# Altium project in3ator.PrjPcb
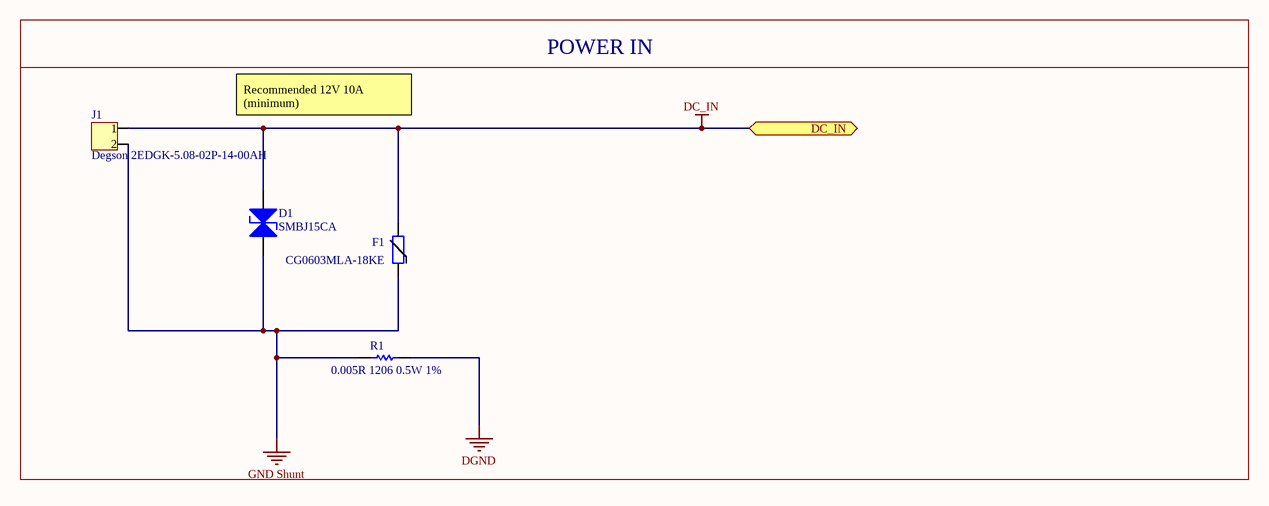
[diagram p0: Power_Input.SchDoc]
Author_in3: Pablo Sánchez Bergasa; Revision_in3: 2.B.1; SheetTotal_in3: 10
3 sheets, 63 parts. Net scope: flat (ports and power ports of the same name join across sheets).
Sheets:
  Power_Input.SchDoc
  Power_management.SchDoc
  Sensors.SchDoc

## Sheet Power_Input.SchDoc: Power input
size A4; SheetNumber: 2

### Parts
D1  SMBJ15CA  [PCB-acsqsz06h0bi34fqghyj-1]
F1  CG0603MLA-18KE  [CAPC1608X60X35NL10T15]
J1  Degson 2EDGK-5.08-02P-14-00AH  [PCB-h4cyb3wxd4gf7j132tzl-1]
R1  0.005R 1206 0.5W 1%  [CAPC3216X180X55ML20T25]

### Blocks framed on the sheet
POWER IN: D1 F1 J1 R1

### Ports
DC_IN

### Nets
DC_IN: D1.2(K) F1.2 J1.1 ; port DC_IN
DGND: R1.1
GND Shunt: D1.1(A) F1.1 J1.2 R1.2

### Notes on the sheet
- Recommended 12V 10A (minimum)
- Title
- Size:
- Date:
- A3
- Author:
- Time:
- Revision:
- Sheet
- of
- File:

### Library data of the parts
D1 = CMP-f09b39914f642f5c-1: SMBJ15 Series 24.4 V 600 W Bi-Directional Transient Voltage Suppressor-DO-214AA; Power Dissipation: 5.00 W; Breakdown Voltage: 16.7 V; Power Rating: 600 W; Octopart URL: http://octopart.com/smbj15ca-littelfuse-39577; Mounting Style: Surface Mount; RoHS: Compliant
F1 = CMP-c3730a7940881cb4-1: Var MOV 14VAC 18VDC 30A 24.2V 0603 SMD Paper T/R Var MOV 14VAC 18VDC 30A 24.2V 0603 SMD Paper T/R; Capacitance: 140 pF; Operating Voltage: 14.0 V; Voltage Rating (DC): 18.0 V; Octopart URL: https://octopart.com/cg0603mla-18ke-bourns-42653; Manufacturer Part Number: CG0603MLA-18KE; Case/Package: 0603; Mounting Style: Surface Mount, Solder; Operating Temperature: -55.0 °C (min); Packaging: Reel; REACH SVHC Compliance: No SVHC; RoHS: Compliant; Size-Height: 813 µm; Size-Length: 1.63 mm; Size-Width: 813 µm; Voltage Rating (AC): 14.0 V; OctopartID: c3730a7940881cb4
J1 = CMP-7a42b7ee166ba585-1: Terminal block, 5mm 2 Pos, through hole male.; Manufacturer Part Number: 2EDGK-5.08-02P-14-00AH + 2EDGVC-5.08-02P; Octopart URL: https://octopart.com/2edgk-5.08-02p-14-00ah-degson-78006607; OctopartID: 7a42b7ee166ba585; Manufacturer Part Number 2: WJ2EDGVC-5.08-2P + WJ2EDGK-5.08-2P
R1 = CMP-0abdc173b10ad57a-1: Manufacturer Part Number: WSLP12065L000FEA; Resistance: 0,024; Power: 1W; Octopart URL: https://octopart.com/1-2176055-0-te+connectivity-46440145; Case/Package: 1206; Lifecycle Status: Not Listed by Manufacturer; Packaging: Tape & Reel (TR); OctopartID: 0abdc173b10ad57a; OrderingCode: WSLP12065L000FEA; Manufacturer Part Number 2: FMF06FTHR005-LHL

## Sheet Power_management.SchDoc: Power
size A3; SheetNumber: 3
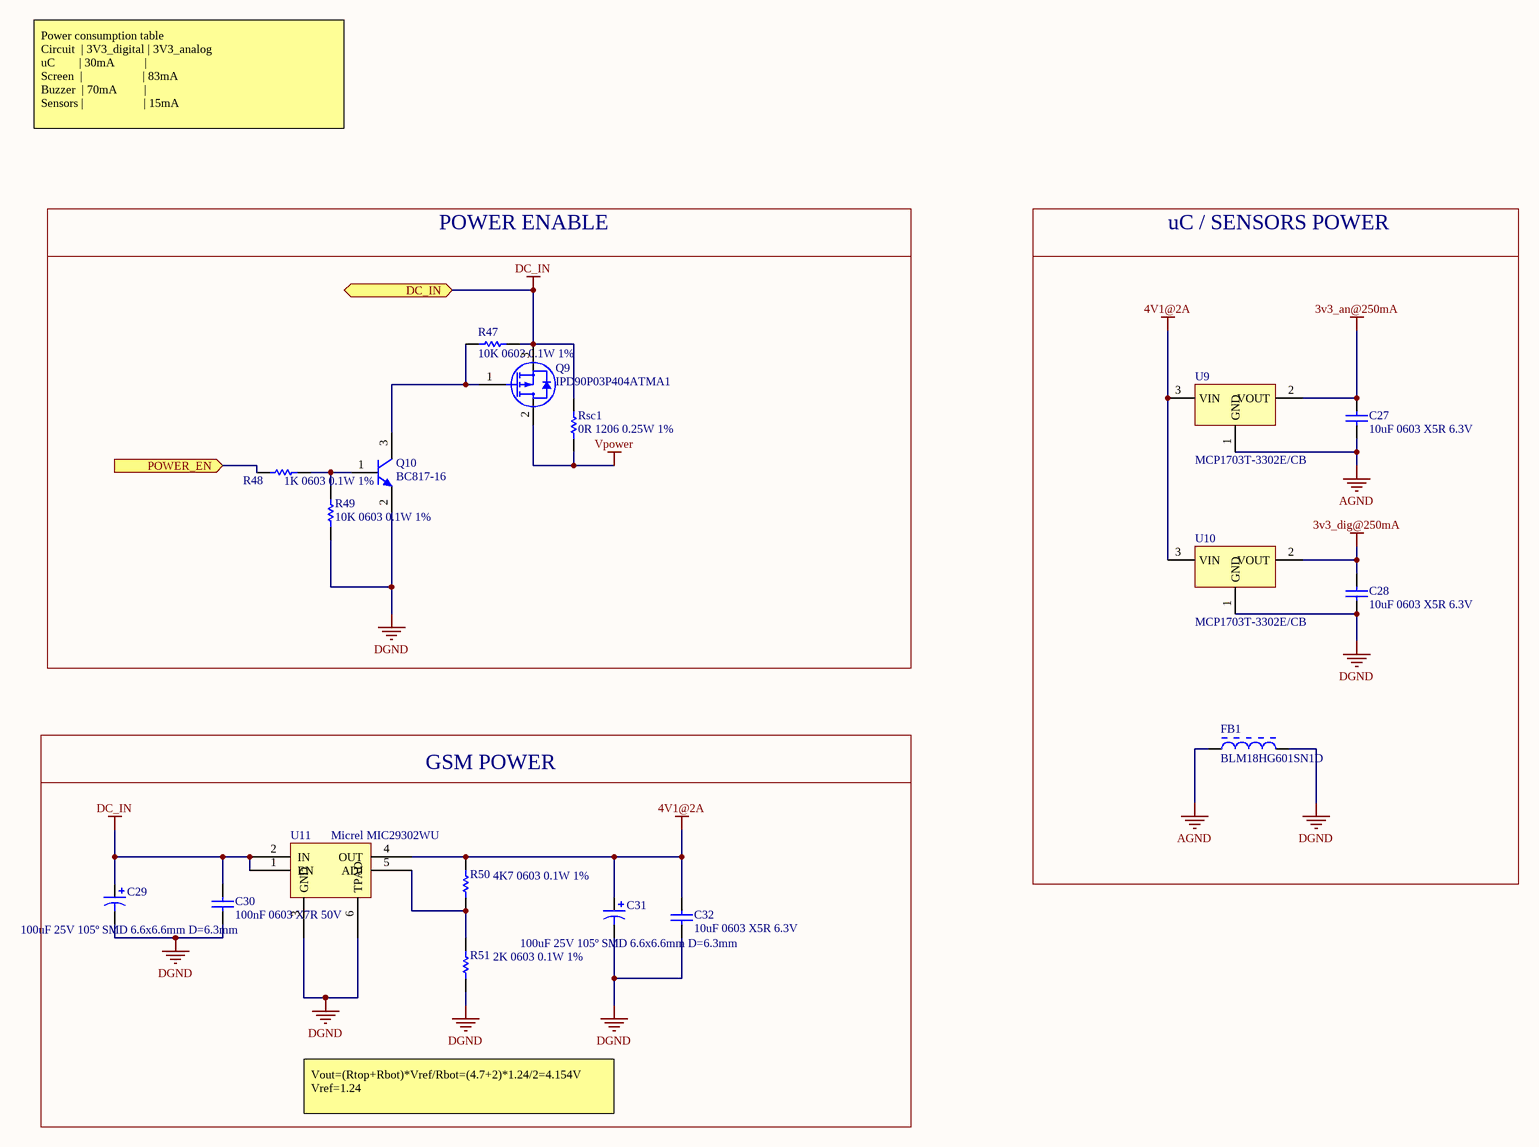
[diagram p1: Power_management.SchDoc]

### Parts
C27  10uF 0603 X5R 6.3V  [CAPC1608X60X35NL10T15]
C28  10uF 0603 X5R 6.3V  [CAPC1608X60X35NL10T15]
C29  100uF 25V 105º SMD 6.6x6.6mm D=6.3mm  [PCB-5eg0a5nygcrzw5ibm1j9-1]
C30  100nF 0603 X7R 50V  [CAPC1608X60X35NL10T15]
C31  100uF 25V 105º SMD 6.6x6.6mm D=6.3mm  [PCB-5eg0a5nygcrzw5ibm1j9-1]
C32  10uF 0603 X5R 6.3V  [CAPC1608X60X35NL10T15]
FB1  BLM18HG601SN1D  [MURA-BLM18-F-H1-CHIP-2_V]
Q9  IPD90P03P404ATMA1  [DPAK IPD90P03P404ATMA1]
Q10  BC817-16  [PCB-856332-1]
R47  10K 0603 0.1W 1%  [RESC1609X55X30ML10T20]
R48  1K 0603 0.1W 1%  [RESC1609X55X30ML10T20]
R49  10K 0603 0.1W 1%  [RESC1609X55X30ML10T20]
R50  4K7 0603 0.1W 1%  [RESC1609X55X30ML10T20]
R51  2K 0603 0.1W 1%  [RESC1609X55X30ML10T20]
Rsc1  0R 1206 0.25W 1%  [PCB-sxvxwfnl72ysl1kmtzgv-1]  (no BOM)
U9  MCP1703T-3302E/CB  [SOT-23A-CB3_L]
U10  MCP1703T-3302E/CB  [SOT-23A-CB3_L]
U11  Micrel MIC29302WU  [TI-KTT5_N]

### Blocks framed on the sheet
POWER ENABLE: Q9 Q10 R47-R49 Rsc1
uC / SENSORS POWER: C27 C28 FB1 U9 U10
GSM POWER: C29-C32 R50 R51 U11

### Ports
DC_IN, POWER_EN (in)

### Nets
3v3_an@250mA: C27.2 U9.2(VOUT)
3v3_dig@250mA: C28.2 U10.2(VOUT)
4V1@2A: C31.1 C32.2 R50.2 U9.3(VIN) U10.3(VIN) U11.4(OUT)
AGND: C27.1 FB1.1 U9.1(GND)
DC_IN: C29.1 C30.2 Q9.3(S) R47.2 Rsc1.2 U11.1(EN) U11.2(IN) ; port DC_IN
DGND: C28.1 C29.2 C30.1 C31.2 C32.1 FB1.2 Q10.2(E) R49.2 R51.1 U10.1(GND) U11.3(GND) U11.6(TPAD)
Vpower: Q9.2(D) Rsc1.1
NetQ9_1: Q9.1(G) Q10.3(C) R47.1
NetQ10_1: Q10.1(B) R48.2 R49.1
NetR48_1: R48.1 ; port POWER_EN
NetR50_1: R50.1 R51.2 U11.5(ADJ)

### Notes on the sheet
- Power consumption table
  Circuit  | 3V3_digital | 3V3_analog
  uC        | 30mA          |
  Screen  |                    | 83mA
  Buzzer  | 70mA         |
  Sensors |                    | 15mA
- Vout=(Rtop+Rbot)*Vref/Rbot=(4.7+2)*1.24/2=4.154V
  Vref=1.24
- Title
- Size:
- Date:
- A3
- Author:
- Time:
- Revision:
- Sheet
- of
- File:

### Library data of the parts
C27 C28 C32 = CMP-121364-8: Rated voltage: 6v3; Dielectric carachteristic: X5R; Capacitance: 10uF; package: 0603
C29 C31 = CMP-a6d16ad512617916-1: Manufacturer Part Number: VZL101M1ETR-0607; Tolerance: 20%; Octopart URL: https://octopart.com/vzl101m1etr-0607-lelon-84840918; OctopartID: a6d16ad512617916; Capacity: 100uF; Voltage rating: 25V
C30 = CMP-c41a0d2b65641bdd-3: 100nF 0603 X7R 25V; package: 0603; capacitance: 100 nF; Dielectric Characteristic: X7R; Rated voltage: 25V
FB1 = CMP-19299602-3: Current Rating: 0.2 A; Frequency: 100000000.0 Hz; Lead-Free Status: Lead Free; Number of Circuits: 1; Resistance: 600.0 Ω; Shielding: No; Value: 600ohm 200mA; Manufacturer Part Number: BLM18HG601SN1D; Case/Package: 0603; Mounting Style: Surface Mount; Number of Pins: 2; Octopart Url: https://octopart.com/blm18hg601sn1d-murata-368340; OctopartID: c121082e7a931ee6; REACH SVHC Compliance: No SVHC; RoHS: Compliant; Size-Height: 0.0008 m; Size-Length: 0.0016 m; Size-Width: 0.0008 m
Q9 = CMP-3103264-6: Single P-Channel 30 V 4.5 mOhm 100 nC OptiMOS Power Mosfet - TO-252-3-11; Lead-Free Status: Lead Free; REACH SVHC Compliance: No SVHC; Octopart URL: https://octopart.com/ipd90p03p404atma1-infineon-21386769; Polarity: P-Channel; RoHS: Compliant; Mounting Style: Surface Mount; Operating Temperature: 175 °C (max); Packaging: Reel; Number of Pins: 3; OctopartID: f6ad3ee185da296a; Manufacturer Part Number: IPD90P03P404ATMA1; Manufacturer Part Number 2: WSF70P03
Q10 = CMP-856332-3: TRANS NPN 45V 500mA SMD SOT23-3; Current Rating: 0.6 A; Lead-Free Status: Lead Free; Power Dissipation: 0.3 W; Voltage Rating (DC): 40.0 V; Case/Package: SOT-23; Lifecycle Status: Active; Mounting Style: Surface Mount; Number of Pins: 3; Octopart Url: https://octopart.com/mmbt2222a-7-f-diodes+inc.-357838; OctopartID: 53a79aa8030f8c60; Packaging: Cut Tape (CT); Polarity: NPN; REACH SVHC Compliance: No SVHC; RoHS: Compliant
R47 R49 = CMP-4716590-9: Octopart Url: https://octopart.com/crcw060310k0fkeahp-vishay-42634028; package: 0603; Resistance: 10k; Tolerance: 1%
  R47: DNP: DNP
R48 = CMP-a61f6f36030f79d8-4: Manufacturer Part Number: CR0603-FX-1001ELF; Power Rating: 100 mW; Case/Package (SI): 1608; Voltage Rating (DC): 50.0 V; Temperature Coefficient: -100 ppm/°C to 100 ppm/°C; REACH SVHC Compliance: No SVHC; Packaging: Tape & Reel (TR), Cut Tape (CT); Resistance Tolerance: ±1%; Resistance: 1k; RoHS: Compliant; Mounting Style: Surface Mount; Number of Pins: 2; Size-Length: 1.60 mm; Octopart URL: https://octopart.com/cr0603-fx-1001elf-bourns-2326646; Size-Thickness: 457 µm; OctopartID: a61f6f36030f79d8; Size-Width: 787 µm; Case/Package: 0603
R50 R51 = CMP-3655986-6: Tolerance: 1%; package: 0603
  R50: Resistance: 4K7
  R51: Resistance: 2K
Rsc1 = CMP-3f1bf473a47ce0dc-5: Manufacturer Part Number: RC1206JR-070RL; Lead-Free Status: Lead Free; Resistance Tolerance: ±5%; Voltage Rating (DC): 200 V; Power Rating: 250 mW; Case/Package (SI): 3216; Resistance: 0R; Packaging: Cut Tape (CT), Tape & Reel (TR); Size-Width: 1.60 mm; Case/Package: 1206; Mounting Style: Surface Mount; Size-Length: 3.10 mm; OctopartID: 3f1bf473a47ce0dc; Number of Pins: 2; RoHS: Compliant
U9 U10 = CMP-1493313-4: Lead-Free Status: Lead Free; Number of Outputs: 1; Output Capacitor Type: Ceramic; Quiescent Current: 2e-06 A; Dropout Voltage: 0.65 V; RoHS: Compliant; Mounting Style: Surface Mount; OctopartID: 3caef5ca6a72e369; Packaging: Cut Tape (CT); Octopart Url: https://octopart.com/mcp1703t-3302e%2Fcb-microchip-7238586; Lifecycle Status: Active; Number of Pins: 3; REACH SVHC Compliance: No SVHC; Manufacturer Part Number: MCP1703T-3302E/CB
U11 = CMP-703eb93c7bacaff9-6: MIC29302 Series 3 A 1.24 to 26 V ADJ Output Voltage LDO Regulator - TO-263-5

## Sheet Sensors.SchDoc: Sensors
size A3; SheetNumber: 7
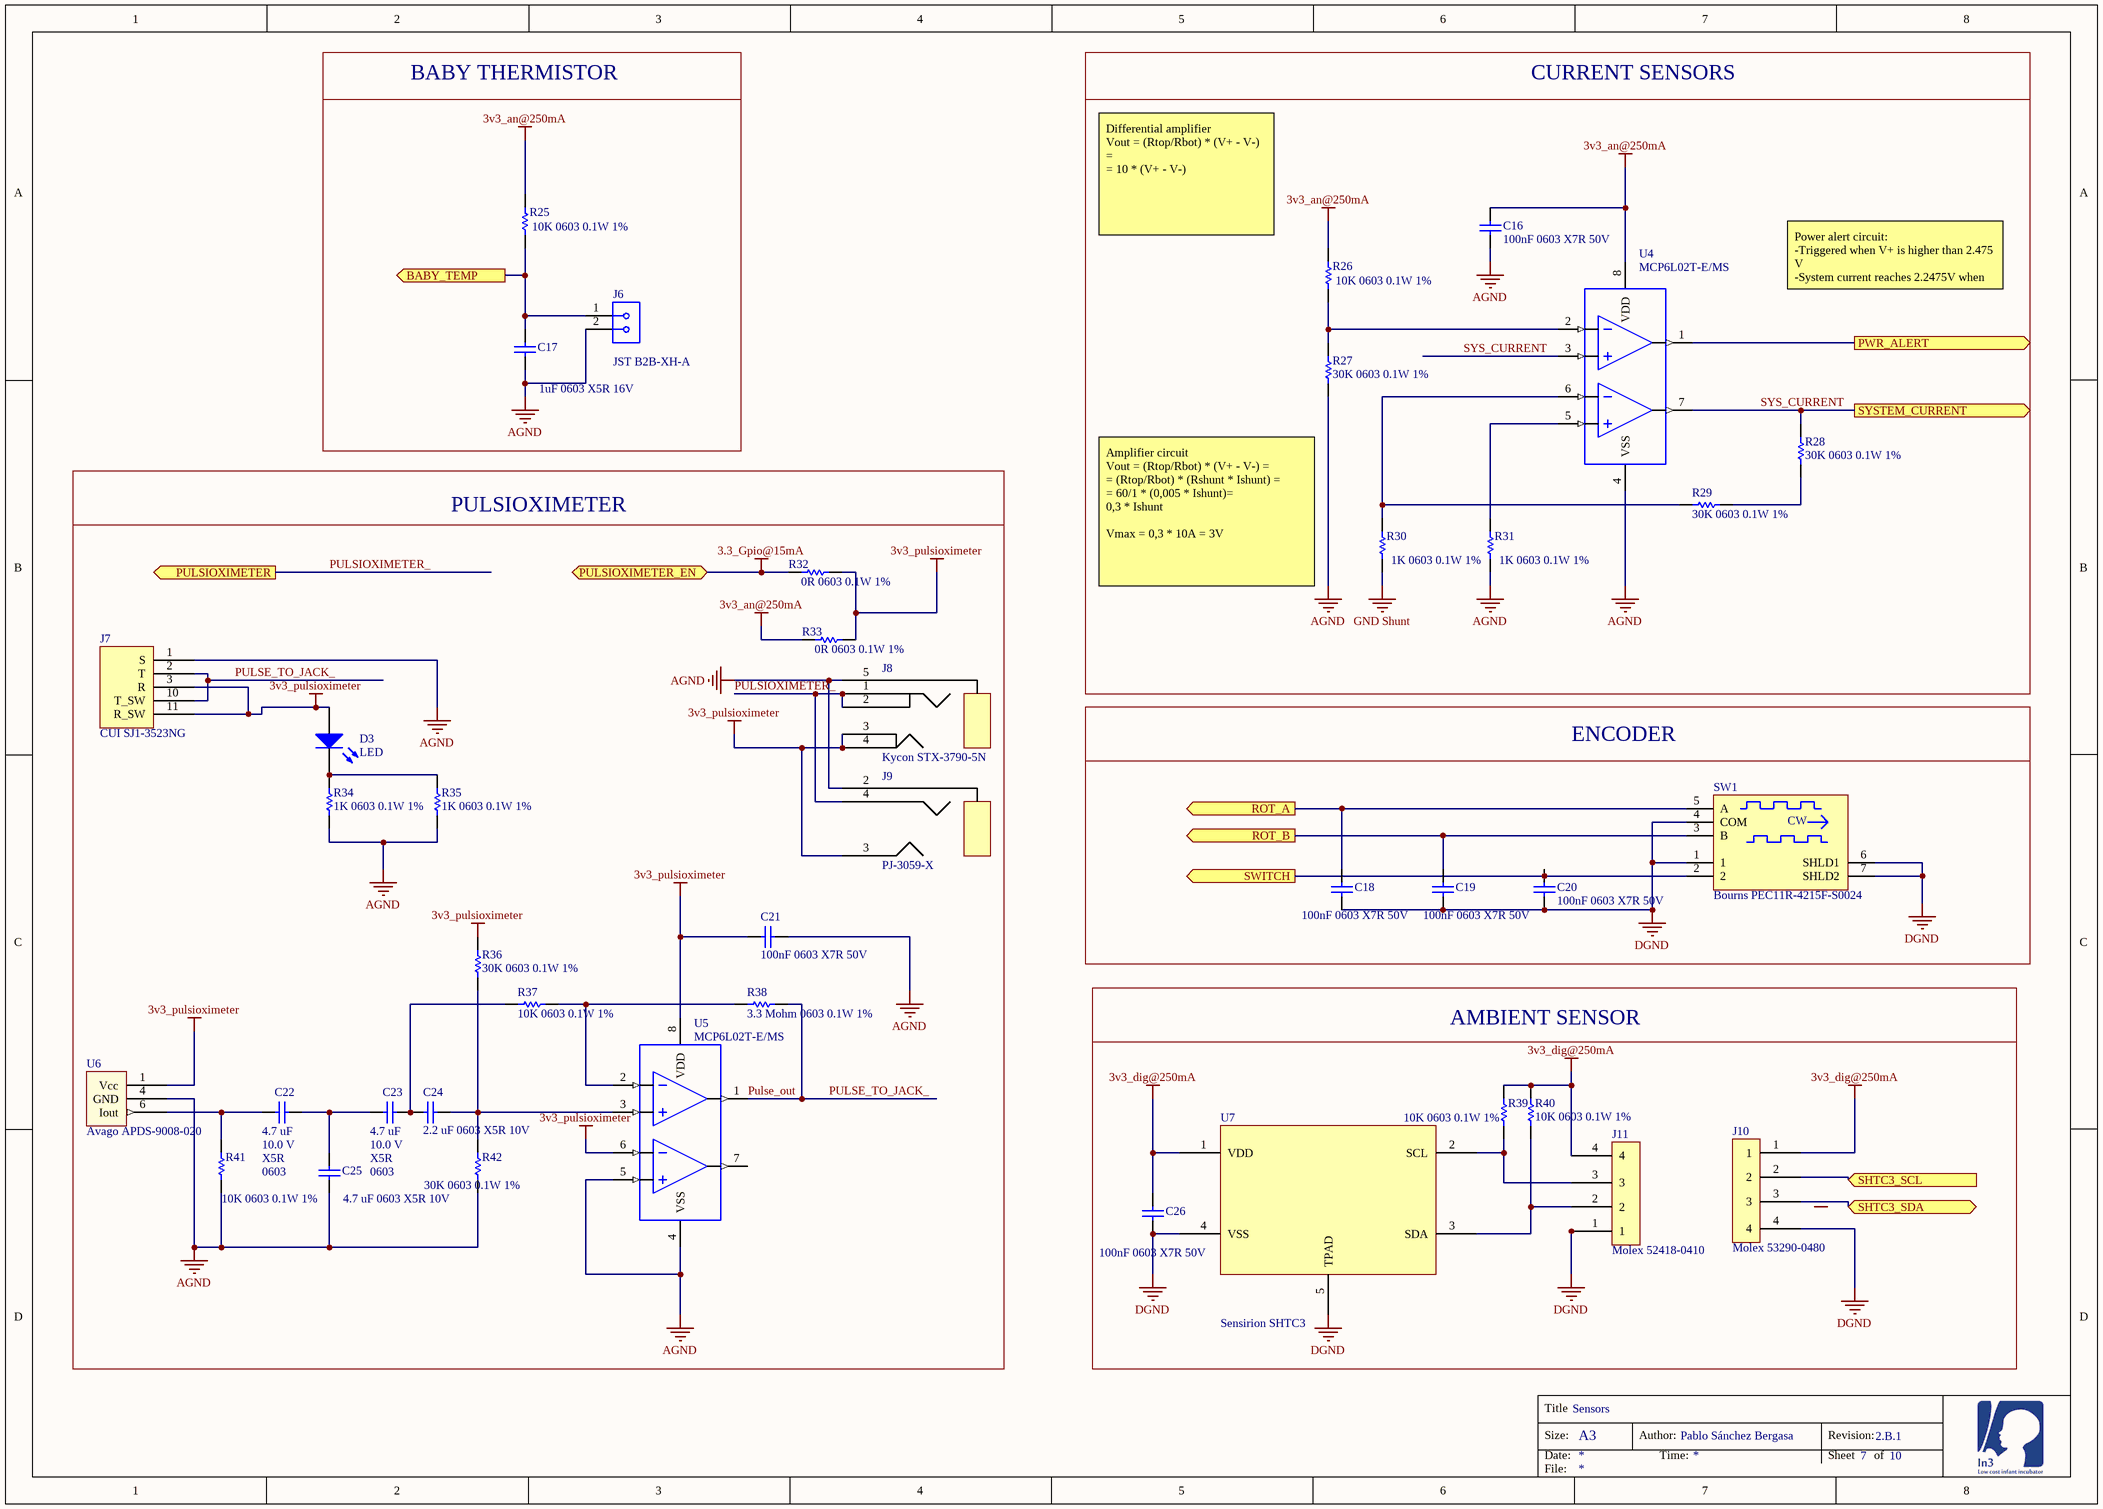
[diagram p2: Sensors.SchDoc]

### Parts
C16  100nF 0603 X7R 50V  [CAPC1608X60X35NL10T15]
C17  1uF 0603 X5R 16V  [CAPC1608X60X35NL10T15]
C18  100nF 0603 X7R 50V  [CAPC1608X60X35NL10T15]
C19  100nF 0603 X7R 50V  [CAPC1608X60X35NL10T15]
C20  100nF 0603 X7R 50V  [CAPC1608X60X35NL10T15]
C21  100nF 0603 X7R 50V  [CAPC1608X60X35NL10T15]
C22  Capacitance: 4.7 uF  Dielectric Characteristic: X5R  Voltage Rating (DC): 10.0 V  Case/Package: 0603  [PCB-o44e25ijbg7jfnbnmamr-1]  (hidden comment: 4.7 uF 0603 X5R 10V)
C23  Capacitance: 4.7 uF  Dielectric Characteristic: X5R  Voltage Rating (DC): 10.0 V  Case/Package: 0603  [PCB-o44e25ijbg7jfnbnmamr-1]  (hidden comment: 4.7 uF 0603 X5R 10V)
C24  2.2 uF 0603 X5R 10V  [PCB-ut6qvzar43b06cy077h6-1]
C25  4.7 uF 0603 X5R 10V  [PCB-o44e25ijbg7jfnbnmamr-1]
C26  100nF 0603 X7R 50V  [CAPC1608X60X35NL10T15]
D3  LED  [Diode]
J6  JST B2B-XH-A  [PCB-pp1at3pfx7vls1ur72ey-1]
J7  CUI SJ1-3523NG  [PCB-fes4koqfmzto7b0d8kf8-1]
J8  Kycon STX-3790-5N  [PCB-4j7k1xhz8vc7zbr3u2za-1]
J9  PJ-3059-X  [PCB-ylnrsqqp1zh2nrt13053-1]
J10  Molex 53290-0480  [PCB-az7j7v00du7ll54n3o04-1]
J11  Molex 52418-0410  [PCB-2exqb8kt510pgx9iz0yo-1]
R25  10K 0603 0.1W 1%  [RESC1609X55X30ML10T20]
R26  10K 0603 0.1W 1%  [RESC1609X55X30ML10T20]
R27  30K 0603 0.1W 1%  [RESC1609X55X30ML10T20]
R28  30K 0603 0.1W 1%  [RESC1609X55X30ML10T20]
R29  30K 0603 0.1W 1%  [RESC1609X55X30ML10T20]
R30  1K 0603 0.1W 1%  [RESC1609X55X30ML10T20]
R31  1K 0603 0.1W 1%  [RESC1609X55X30ML10T20]
R32  0R 0603 0.1W 1%  [RESC1609X55X30ML10T20]
R33  0R 0603 0.1W 1%  [RESC1609X55X30ML10T20]
R34  1K 0603 0.1W 1%  [RESC1609X55X30ML10T20]
R35  1K 0603 0.1W 1%  [RESC1609X55X30ML10T20]
R36  30K 0603 0.1W 1%  [RESC1609X55X30ML10T20]
R37  10K 0603 0.1W 1%  [RESC1609X55X30ML10T20]
R38  3.3 Mohm 0603 0.1W 1%  [PCB-mzxdg9kz9211q53vmmjz-1]
R39  10K 0603 0.1W 1%  [RESC1609X55X30ML10T20]
R40  10K 0603 0.1W 1%  [RESC1609X55X30ML10T20]
R41  10K 0603 0.1W 1%  [RESC1609X55X30ML10T20]
R42  30K 0603 0.1W 1%  [RESC1609X55X30ML10T20]
SW1  Bourns PEC11R-4215F-S0024  [BOUR-PEC11R-4XXXF-SXXXX_V]
U4  MCP6L02T-E/MS  [PCB-e8n0jpjj0ctkgxf737qv-1]
U5  MCP6L02T-E/MS  [PCB-e8n0jpjj0ctkgxf737qv-1]
U6  Avago APDS-9008-020  [PCB-5zuy5omviewwv0vuvsb9-1]
U7  Sensirion SHTC3  [DFN4 2x2 + EP]

### Blocks framed on the sheet
BABY THERMISTOR: C17 J6 R25
CURRENT SENSORS: C16 R26-R31 U4
PULSIOXIMETER: C21-C25 D3 J7-J9 R32-R38 R41 R42 U5 U6
ENCODER: C18-C20 SW1
AMBIENT SENSOR: C26 J10 J11 R39 R40 U7

### Ports
BABY_TEMP (out), PULSIOXIMETER (out), PULSIOXIMETER_EN, PWR_ALERT (out), ROT_A (out), ROT_B (out), SHTC3_SCL (in), SHTC3_SDA (bidir), SWITCH (out), SYSTEM_CURRENT (out)

### Nets
3.3_Gpio@15mA: R32.1 ; port PULSIOXIMETER_EN
3v3_an@250mA: C16.2 R25.2 R26.2 R33.1 U4.8(VDD)
3v3_dig@250mA: C26.1 J10.1 J11.4 R39.1 R40.1 U7.1(VDD)
3v3_pulsioximeter: C21.2 D3.1(A) J7.3(R) J7.11(R_SW) J8.3(RIGHT) J8.4(LEFT) J9.3(LEFT) R32.2 R33.2 R36.1 U5.6(VINB-) U5.8(VDD) U6.1(Vcc)
AGND: C16.1 C17.2 C21.1 C25.2 J6.2 J7.1(S) J8.5(GND) J9.2(GND) R27.2 R31.1 R34.1 R35.1 R41.1 R42.2 U4.4(VSS) U5.4(VSS) U5.5(VINB+) U6.4(GND)
DGND: C18.1 C19.1 C20.1 C26.2 J10.4 J11.1 SW1.1 SW1.4(COM) SW1.6(SHLD1) SW1.7(SHLD2) U7.4(VSS) U7.5(TPAD)
GND Shunt: R30.1
Pulse_out: J7.2(T) J7.10(T_SW) R38.2 U5.1(VOUTA)  [also labelled PULSE_TO_JACK_]
PULSIOXIMETER_: J8.1(RIGHT) J8.2(RIGHT) J9.4(RIGHT) ; port PULSIOXIMETER
SYS_CURRENT: R28.1 U4.3(VINA+) U4.7(OUT_B) ; port SYSTEM_CURRENT
NetC17_1: C17.1 J6.1 R25.1 ; port BABY_TEMP
NetC18_2: C18.2 SW1.5(A) ; port ROT_A
NetC19_2: C19.2 SW1.3(B) ; port ROT_B
NetC20_2: C20.2 SW1.2 ; port SWITCH
NetC22_1: C22.1 C23.2 C25.1
NetC22_2: C22.2 R41.2 U6.6(Iout)
NetC23_1: C23.1 C24.2 R37.2
NetC24_1: C24.1 R36.2 R42.1 U5.3(VINA+)
NetD3_2: D3.2(K) R34.2 R35.2
NetJ10_2: J10.2 ; port SHTC3_SCL
NetJ10_3: J10.3 ; port SHTC3_SDA
NetJ11_2: J11.2 R40.2 U7.3(SDA)
NetJ11_3: J11.3 R39.2 U7.2(SCL)
NetR26_1: R26.1 R27.1 U4.2(VINA-)
NetR28_2: R28.2 R29.2
NetR29_1: R29.1 R30.2 U4.6(VINB-)
NetR31_2: R31.2 U4.5(VINB+)
NetR37_1: R37.1 R38.1 U5.2(VINA-)
NetU4_1: U4.1(VOUTA) ; port PWR_ALERT

Not connected (* = marked no-connect by the designer): U5 7(OUT_B)

### Notes on the sheet
- Differential amplifier
  Vout = (Rtop/Rbot) * (V+ - V-) =
  = 10 * (V+ - V-)
- Power alert circuit:
  -Triggered when V+ is higher than 2.475 V
  -System current reaches 2.2475V when 8.25A are drawn
- Amplifier circuit
  Vout = (Rtop/Rbot) * (V+ - V-) =
  = (Rtop/Rbot) * (Rshunt * Ishunt) =
  = 60/1 * (0,005 * Ishunt)=
  0,3 * Ishunt
  Vmax = 0,3 * 10A = 3V
- Title
- Size:
- Date:
- A3
- Author:
- Time:
- Revision:
- Sheet
- of
- File:
- (in symbol CMP-7675167-7) CW

### Library data of the parts
C16 C18-C21 C26 = CMP-c41a0d2b65641bdd-3: 100nF 0603 X7R 25V; package: 0603; capacitance: 100 nF; Dielectric Characteristic: X7R; Rated voltage: 25V
C17 = CMP-119984-2: Manufacturer Part Number: GRM185R61C105KE44D; Capacitance Tolerance: ±10%; Case/Package (in): 0603; Lead-Free Status: Lead Free; Capacitance: 1uF; Dielectric Characteristic: X5R; Lifecycle Status: Active; Mounting Style: Surface Mount; Number of Pins: 2; Octopart Url: https://octopart.com/grm185r61c105ke44d-murata-197446; OctopartID: de3e1737f81e01f9; REACH SVHC Compliance: No SVHC; RoHS: Compliant; Size-Height: 0.0005 m; Size-Length: 0.0016 m; Size-Thickness: 0.0005 m; Size-Width: 0.0008 m; Rated voltage: 16V
C22 C23 = CMP-4caf8516eb679368-2: CL10 Series 4.7 uF 10 V ±10 % Tolerance X5R SMT Multilayer Ceramic Capacitor; Manufacturer Part Number: CL10A475KP8NNNC; Capacitance Tolerance: ±10%; Lead-Free Status: Lead Free; OctopartID: 4caf8516eb679368; Octopart URL: http://octopart.com/cl10a475kp8nnnc-samsung-11764398; Mounting Style: Surface Mount; RoHS: Compliant
C24 = CMP-3568fc1ddfcfeaaf-3: Capacitor: ceramic; MLCC; 2.2uF; 10V; X5R; ±10%; SMD; 0603; -55÷85°C; Manufacturer Part Number: CL10A225KP8NNNC; Capacitance: 2.20 µF; Manufacturer Part Number 2: EMK107BJ225MA-T
C25 = CMP-4caf8516eb679368-2: CL10 Series 4.7 uF 10 V ±10 % Tolerance X5R SMT Multilayer Ceramic Capacitor; Manufacturer Part Number: CL10A475KP8NNNC; Capacitance: 4.7 uF; Capacitance Tolerance: ±10%; Lead-Free Status: Lead Free; Voltage Rating (DC): 10.0 V; OctopartID: 4caf8516eb679368; Octopart URL: http://octopart.com/cl10a475kp8nnnc-samsung-11764398; Mounting Style: Surface Mount; Dielectric Characteristic: X5R; Case/Package: 0603; RoHS: Compliant
D3 = CMP-528b9bd0c0208d4c-1: Green 2.5 x 2 x 2.8 mm 20° Clear 2700 mcd 3.3 V Subminiature Solid State LED SMT; Manufacturer Part Number: AM2520ZGC09; Lead-Free Status: Lead Free; RoHS: Compliant
J6 = CMP-1d67d451da9ec2a0-3: Conn Shrouded Header HDR 2 POS 2.5mm Solder ST Thru-Hole Box; Contact Material: Phosphor Bronze; OctopartID: 1d67d451da9ec2a0; Orientation: Straight; Octopart URL: https://octopart.com/b2b-xh-a-jst-3990175; Manufacturer Part Number: B2B-XH-A
J7 = CMP-6d54a45d2240b293-5: Conn 3.5MM Stereo Jack RCP 3 POS Solder RA Thru-Hole 3 Terminal 1 Port; Manufacturer Part Number: SJ1-3523NG; Manufacturer Part Number 2: PJ-307C
J8 = CMP-d3711b49a5340cb6-2: Conn Audio RCP 5 POS Solder ST Thru-Hole 5 Terminal 1 Port; Gender: Female; RoHS: Compliant; Octopart URL: https://octopart.com/stx-3790-5n-kycon-20075299; OctopartID: d3711b49a5340cb6; Packaging: Tray; Mounting Style: Through Hole; Manufacturer Part Number: STX-3790-5N; Color: Black
J9 = CMP-qu24ppwf8ue4q4dth5co-2: 3.5mm Plug-in headphone holder; CustomComponentID: qu24ppwf8ue4q4dth5co
J10 = CMP-77b5bebc9fe3a872-2: Molex; SER Number 53290; 2mm Pitch 4Way 1Row Straight PCB Header; Solder Term; 1.5A; Mated Height: 6.00 mm; Gender: Male; Number of Contacts: 4; Current Rating: 1.50 A; Number of Circuits: 3, 4; Lead-Free Status: Lead Free; Pin Pitch: 2.00 mm; Glow Wire Compliant: Non-Compliant; Number of Rows: 1; Lifecycle Status: Active; OctopartID: 77b5bebc9fe3a872; Mounting Style: Through Hole; Size-Height: 6.00 mm; Size-Width: 3.70 mm; Operating Temperature: 105 °C (max); Octopart URL: https://octopart.com/53290-0480-molex-249136; Packaging: Bulk; RoHS: Compliant; Contact Plating: Tin; Halogen Free Status: Not Halogen Free; Manufacturer Part Number: 53290-0480; Number of Positions: 4; Size-Length: 11.0 mm; Orientation: Vertical
J11 = CMP-efff26f6ba583038-1: 2.00mm Pitch Board-to-Board Receptacle, Right Angle, Single Row, Friction Lock, 4 Circuits; Contact Resistance: 20.0 m? (max); Current Rating: 1.50 A; Gender: Female; Glow Wire Compliant: Non-Compliant; Insulation Resistance: 1.00 G? (min); Lead-Free Status: Lead Free; Number of Circuits: 3, 4; Number of Contacts: 4; Octopart URL: https://octopart.com/52418-0410-molex-225473; Manufacturer Part Number: 52418-0410; Contact Material: Phosphor Bronze; Contact Plating: Tin; Flammability Rating: UL 94 V-0; Halogen Free Status: Not Low Halogen; Housing Material: Plastic; Lifecycle Status: Active; Mounting Style: Through Hole; Number of Positions: 4; Number of Rows: 1; Operating Temperature: 105 °C (max); Orientation: Right Angle; Packaging: Tray; Pin Pitch: 2.00 mm; REACH SVHC Compliance: No SVHC; RoHS: Compliant; Size-Height: 3.15 mm; Size-Length: 9.50 mm; Size-Width: 4.00 mm; OctopartID: efff26f6ba583038
R25 R26 R37 R39-R41 = CMP-4716590-9: Octopart Url: https://octopart.com/crcw060310k0fkeahp-vishay-42634028; package: 0603; Resistance: 10k; Tolerance: 1%
R27-R29 R36 R42 = CMP-3655986-6: Resistance: 30k; Tolerance: 1%; package: 0603
R30 R31 R34 R35 = CMP-a61f6f36030f79d8-4: as R48 on sheet Power_management; REACH SVHC Compliance: No SVHC; Packaging: Tape & Reel (TR), Cut Tape (CT); Resistance Tolerance: ±1%; Resistance: 1k; RoHS: Compliant; Mounting Style: Surface Mount; Number of Pins: 2; Size-Length: 1.60 mm; Octopart URL: https://octopart.com/cr0603-fx-1001elf-bourns-2326646; Size-Thickness: 457 µm; OctopartID: a61f6f36030f79d8; Size-Width: 787 µm; Case/Package: 0603
R32 R33 = CMP-536b9a7387ce8cac-10: HelpURL: http://www.yageo.com/documents/recent/PYu-RC_Group_51_RoHS_L_9.pdf; Resistance: 0R; package: 0603
R38 = CMP-0de3c699ccb2d224-2: Res Thick Film 1.6 x 0.8 mm 330K Ohm 1% 0.1W(1/10W) 100ppm/ C Molded SMD Paper T/R; Manufacturer Part Number: RC0603FR-07330KL; Resistance: 330 kΩ; Lead-Free Status: Lead Free; OctopartID: 0de3c699ccb2d224; Size-Length: 1.60 mm; Number of Pins: 2; Size-Width: 800 µm; Resistance Tolerance: ±1%
SW1 = CMP-7675167-7: 12 mm Incremental Encoder, 24 Detent, -30 to 70 degC, 5-Pin THD, RoHS, Bulk; Number of Detents: 24; Size-Length: 13.4 mm; Seller Landing  Url: https://octopart.com/click/track?country=US&ak=8157f166&sig=0be53b6&sid=1106&ppid=26648293&vpid=76310724&ct=offers; Manufacturer Part Number: PEC11R-4215F-S0024; ComponentLink2Description: Datasheet; Octopart Url: http://octopart.com/pec11r-4215f-s0024-bourns-26648293; ComponentLink1URL: http://www.bourns.com/; RoHS: Compliant; ComponentLink1Description: Manufacturer URL; PackageReference: PEC11R-4XXXF-SXXXX; PackageDescription: 5-Pin Through Hole Device, Body 12.5 x 13.4 mm; Size-Width: 12.5 mm; OctopartID: f33f3ba348bc2cf8; DatasheetVersion: Jul-14; ComponentLink2URL: http://www.bourns.com/docs/Product-Datasheets/PEC11R.pdf; REACH SVHC Compliance: No SVHC
U4 U5 = CMP-1319549-4: Microchip MCP6L02T-E/MS, Dual Op Amp, 1MHz Rail-Rail, 1.8 to 6 V, 8-Pin MSOP
U6 = CMP-1600df74f371c9c7-1: Ambient Light Sensor Photodetector 6-Pin SMD T/R; Output Current: 40.0 A; Peak Wavelength: 565 nm; Lifecycle Status: Not Listed by Manufacturer; Manufacturer Part Number: APDS-9008-020; OctopartID: 1600df74f371c9c7; RoHS: Compliant; Octopart URL: http://octopart.com/apds-9008-020-avago-8306711
U7 = CMP-a59169e1f8d67a56-4: Humidity & Temperature Sensor ±2% RH ±0, 2°C I2C DFN4; OctopartID: a59169e1f8d67a56

## Nets that join several sheets
3v3_an@250mA: Power_management (C27.2 U9.2), Sensors (5 pins)
3v3_dig@250mA: Power_management (C28.2 U10.2), Sensors (6 pins)
AGND: Power_management (C27.1 FB1.1 U9.1), Sensors (18 pins)
DC_IN: Power_Input (D1.2 F1.2 J1.1), Power_management (7 pins)
DGND: Power_Input (R1.1), Power_management (12 pins), Sensors (12 pins)
GND Shunt: Power_Input (D1.1 F1.1 J1.2 R1.2), Sensors (R30.1)

## Assembly variants
Main: not fitted C9 C9 C10 C10 F1 J2 J3 J8 J12 R9 R33 RF_1 Rsc U3